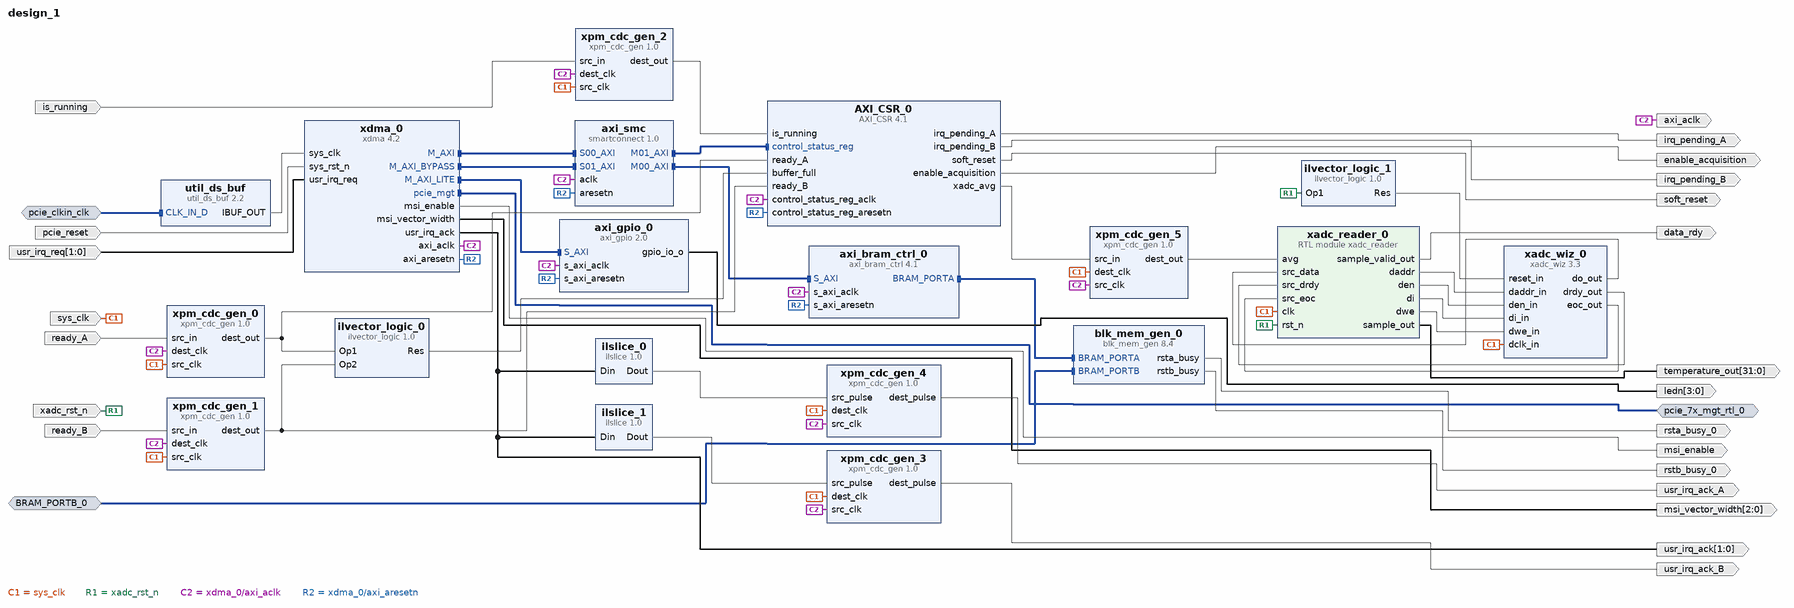
[diagram p0: block diagram of the top level]
# Vivado block design design_1, xc7a100tfgg484-2, Vivado 2025.2
create_bd_design design_1

create_bd_intf_port -mode Master -vlnv xilinx.com:interface:pcie_7x_mgt_rtl:1.0 pcie_7x_mgt_rtl_0
create_bd_intf_port -mode Slave -vlnv xilinx.com:interface:diff_clock_rtl:1.0 pcie_clkin_clk
set_property -dict {CONFIG.FREQ_HZ 100000000} [get_bd_intf_ports pcie_clkin_clk]
create_bd_intf_port -mode Slave -vlnv xilinx.com:interface:bram_rtl:1.0 BRAM_PORTB_0
set_property -dict {CONFIG.MASTER_TYPE BRAM_CTRL CONFIG.READ_WRITE_MODE READ_WRITE} [get_bd_intf_ports BRAM_PORTB_0]
create_bd_port -dir I -type rst pcie_reset
set_property -dict {CONFIG.POLARITY ACTIVE_LOW} [get_bd_ports pcie_reset]
create_bd_port -dir O -from 3 -to 0 -type data ledn
create_bd_port -dir O -type clk axi_aclk
create_bd_port -dir O enable_acquisition
create_bd_port -dir I is_running
create_bd_port -dir O rsta_busy_0
create_bd_port -dir O rstb_busy_0
create_bd_port -dir I -from 1 -to 0 -type intr usr_irq_req
set_property -dict {CONFIG.PortWidth 2} [get_bd_ports usr_irq_req]
create_bd_port -dir O -from 1 -to 0 usr_irq_ack
create_bd_port -dir O msi_enable
create_bd_port -dir O -from 2 -to 0 -type data msi_vector_width
create_bd_port -dir O irq_pending_A
create_bd_port -dir O irq_pending_B
create_bd_port -dir I ready_A
create_bd_port -dir I ready_B
create_bd_port -dir O -type rst soft_reset
create_bd_port -dir I -type clk sys_clk
set_property -dict {CONFIG.CLK_DOMAIN design_1_sys_clk CONFIG.FREQ_HZ 200000000} [get_bd_ports sys_clk]
create_bd_port -dir O usr_irq_ack_A
create_bd_port -dir O usr_irq_ack_B
create_bd_port -dir I -type rst xadc_rst_n
create_bd_port -dir O -from 31 -to 0 temperature_out
create_bd_port -dir O data_rdy

create_bd_cell -type ip -vlnv xilinx.com:ip:xdma:4.2 xdma_0
set_property -dict [list \
  CONFIG.axi_data_width 64_bit \
  CONFIG.axilite_master_en true \
  CONFIG.axist_bypass_en true \
  CONFIG.axist_bypass_scale Megabytes \
  CONFIG.axist_bypass_size 1 \
  CONFIG.axisten_freq 250 \
  CONFIG.cfg_mgmt_if false \
  CONFIG.enable_gtwizard false \
  CONFIG.pciebar2axibar_axist_bypass 0x44A0_0000 \
  CONFIG.pf0_class_code_base FF \
  CONFIG.pf0_class_code_interface 00 \
  CONFIG.pf0_class_code_sub 00 \
  CONFIG.pf0_device_id 7021 \
  CONFIG.pf0_interrupt_pin NONE \
  CONFIG.pl_link_cap_max_link_speed 5.0_GT/s \
  CONFIG.pl_link_cap_max_link_width X4 \
  CONFIG.plltype QPLL1 \
  CONFIG.ref_clk_freq 100_MHz \
  CONFIG.xdma_axi_intf_mm AXI_Memory_Mapped \
  CONFIG.xdma_num_usr_irq 2 \
  CONFIG.xdma_rnum_chnl 1 \
  CONFIG.xdma_wnum_chnl 1 \
] [get_bd_cells xdma_0]
create_bd_cell -type ip -vlnv xilinx.com:ip:axi_gpio:2.0 axi_gpio_0
set_property -dict {CONFIG.C_ALL_OUTPUTS 1 CONFIG.C_DOUT_DEFAULT 0x00000101 CONFIG.C_GPIO_WIDTH 4} [get_bd_cells axi_gpio_0]
create_bd_cell -type ip -vlnv xilinx.com:ip:util_ds_buf:2.2 util_ds_buf
set_property -dict {CONFIG.C_BUF_TYPE IBUFDSGTE} [get_bd_cells util_ds_buf]
create_bd_cell -type ip -vlnv xilinx.com:ip:axi_bram_ctrl:4.1 axi_bram_ctrl_0
set_property -dict {CONFIG.SINGLE_PORT_BRAM 1} [get_bd_cells axi_bram_ctrl_0]
create_bd_cell -type ip -vlnv xilinx.com:ip:blk_mem_gen:8.4 blk_mem_gen_0
set_property -dict {CONFIG.Memory_Type True_Dual_Port_RAM} [get_bd_cells blk_mem_gen_0]
create_bd_cell -type ip -vlnv xilinx.com:ip:smartconnect:1.0 axi_smc
set_property -dict {CONFIG.NUM_MI 2 CONFIG.NUM_SI 2} [get_bd_cells axi_smc]
create_bd_cell -type ip -vlnv Nizar_Homebrew:user:AXI_CSR:4.1 AXI_CSR_0
create_bd_cell -type ip -vlnv xilinx.com:ip:xpm_cdc_gen:1.0 xpm_cdc_gen_0
set_property -dict {CONFIG.CDC_TYPE xpm_cdc_single CONFIG.DEST_SYNC_FF 2} [get_bd_cells xpm_cdc_gen_0]
create_bd_cell -type ip -vlnv xilinx.com:ip:xpm_cdc_gen:1.0 xpm_cdc_gen_1
set_property -dict {CONFIG.CDC_TYPE xpm_cdc_single CONFIG.DEST_SYNC_FF 2} [get_bd_cells xpm_cdc_gen_1]
create_bd_cell -type ip -vlnv xilinx.com:ip:xpm_cdc_gen:1.0 xpm_cdc_gen_2
set_property -dict {CONFIG.CDC_TYPE xpm_cdc_single CONFIG.DEST_SYNC_FF 2} [get_bd_cells xpm_cdc_gen_2]
create_bd_cell -type inline_hdl -vlnv xilinx.com:inline_hdl:ilvector_logic:1.0 ilvector_logic_0
set_property -dict {CONFIG.C_SIZE 1} [get_bd_cells ilvector_logic_0]
create_bd_cell -type ip -vlnv xilinx.com:ip:xpm_cdc_gen:1.0 xpm_cdc_gen_3
set_property -dict {CONFIG.CDC_TYPE xpm_cdc_pulse CONFIG.DEST_SYNC_FF 2 CONFIG.RST_USED false} [get_bd_cells xpm_cdc_gen_3]
create_bd_cell -type ip -vlnv xilinx.com:ip:xpm_cdc_gen:1.0 xpm_cdc_gen_4
set_property -dict {CONFIG.CDC_TYPE xpm_cdc_pulse CONFIG.DEST_SYNC_FF 2 CONFIG.RST_USED false} [get_bd_cells xpm_cdc_gen_4]
create_bd_cell -type inline_hdl -vlnv xilinx.com:inline_hdl:ilslice:1.0 ilslice_0
set_property -dict {CONFIG.DIN_WIDTH 2} [get_bd_cells ilslice_0]
create_bd_cell -type inline_hdl -vlnv xilinx.com:inline_hdl:ilslice:1.0 ilslice_1
set_property -dict {CONFIG.DIN_FROM 1 CONFIG.DIN_TO 1 CONFIG.DIN_WIDTH 2} [get_bd_cells ilslice_1]
create_bd_cell -type module -reference xadc_reader xadc_reader_0
create_bd_cell -type ip -vlnv xilinx.com:ip:xadc_wiz:3.3 xadc_wiz_0
set_property -dict [list \
  CONFIG.ADC_CONVERSION_RATE 40 \
  CONFIG.CHANNEL_AVERAGING 16 \
  CONFIG.DCLK_FREQUENCY 200 \
  CONFIG.ENABLE_RESET true \
  CONFIG.INTERFACE_SELECTION ENABLE_DRP \
  CONFIG.OT_ALARM false \
  CONFIG.SENSOR_OFFSET_AND_GAIN_CALIBRATION true \
  CONFIG.SINGLE_CHANNEL_SELECTION TEMPERATURE \
  CONFIG.USER_TEMP_ALARM false \
  CONFIG.VCCAUX_ALARM false \
  CONFIG.VCCINT_ALARM false \
] [get_bd_cells xadc_wiz_0]
create_bd_cell -type inline_hdl -vlnv xilinx.com:inline_hdl:ilvector_logic:1.0 ilvector_logic_1
set_property -dict {CONFIG.C_OPERATION not CONFIG.C_SIZE 1} [get_bd_cells ilvector_logic_1]
create_bd_cell -type ip -vlnv xilinx.com:ip:xpm_cdc_gen:1.0 xpm_cdc_gen_5
set_property -dict {CONFIG.DEST_SYNC_FF 2 CONFIG.SIM_ASSERT_CHK true} [get_bd_cells xpm_cdc_gen_5]

# ---- connections ----

connect_bd_intf_net -intf_net BRAM_PORTB_0_1 [get_bd_intf_ports BRAM_PORTB_0] [get_bd_intf_pins blk_mem_gen_0/BRAM_PORTB]
connect_bd_intf_net [get_bd_intf_pins blk_mem_gen_0/BRAM_PORTA] [get_bd_intf_pins axi_bram_ctrl_0/BRAM_PORTA]
connect_bd_intf_net [get_bd_intf_pins axi_smc/M00_AXI] [get_bd_intf_pins axi_bram_ctrl_0/S_AXI]
connect_bd_intf_net [get_bd_intf_pins axi_smc/M01_AXI] [get_bd_intf_pins AXI_CSR_0/control_status_reg]
connect_bd_intf_net -intf_net diff_clock_rtl_0_1 [get_bd_intf_ports pcie_clkin_clk] [get_bd_intf_pins util_ds_buf/CLK_IN_D]
connect_bd_intf_net [get_bd_intf_pins xdma_0/M_AXI] [get_bd_intf_pins axi_smc/S00_AXI]
connect_bd_intf_net [get_bd_intf_pins xdma_0/M_AXI_BYPASS] [get_bd_intf_pins axi_smc/S01_AXI]
connect_bd_intf_net [get_bd_intf_pins xdma_0/M_AXI_LITE] [get_bd_intf_pins axi_gpio_0/S_AXI]
connect_bd_intf_net [get_bd_intf_ports pcie_7x_mgt_rtl_0] [get_bd_intf_pins xdma_0/pcie_mgt]
connect_bd_net [get_bd_pins AXI_CSR_0/irq_pending_A] [get_bd_ports irq_pending_A]
connect_bd_net [get_bd_pins AXI_CSR_0/irq_pending_B] [get_bd_ports irq_pending_B]
connect_bd_net [get_bd_pins AXI_CSR_0/soft_reset] [get_bd_ports soft_reset]
connect_bd_net [get_bd_pins AXI_CSR_0/xadc_avg] [get_bd_pins xpm_cdc_gen_5/src_in]
connect_bd_net [get_bd_pins AXI_CSR_0/enable_acquisition] [get_bd_ports enable_acquisition]
connect_bd_net [get_bd_pins axi_gpio_0/gpio_io_o] [get_bd_ports ledn]
connect_bd_net [get_bd_pins blk_mem_gen_0/rsta_busy] [get_bd_ports rsta_busy_0]
connect_bd_net [get_bd_pins blk_mem_gen_0/rstb_busy] [get_bd_ports rstb_busy_0]
connect_bd_net [get_bd_pins ilslice_0/Dout] [get_bd_pins xpm_cdc_gen_4/src_pulse]
connect_bd_net [get_bd_pins ilslice_1/Dout] [get_bd_pins xpm_cdc_gen_3/src_pulse]
connect_bd_net [get_bd_pins ilvector_logic_0/Res] [get_bd_pins AXI_CSR_0/buffer_full]
connect_bd_net [get_bd_pins ilvector_logic_1/Res] [get_bd_pins xadc_wiz_0/reset_in]
connect_bd_net [get_bd_ports is_running] [get_bd_pins xpm_cdc_gen_2/src_in]
connect_bd_net [get_bd_ports ready_A] [get_bd_pins xpm_cdc_gen_0/src_in]
connect_bd_net [get_bd_ports ready_B] [get_bd_pins xpm_cdc_gen_1/src_in]
connect_bd_net -net reset_rtl_0_1 [get_bd_ports pcie_reset] [get_bd_pins xdma_0/sys_rst_n]
connect_bd_net -net src_clk_1 [get_bd_ports sys_clk] \
  [get_bd_pins xpm_cdc_gen_0/src_clk] [get_bd_pins xpm_cdc_gen_2/src_clk] [get_bd_pins xpm_cdc_gen_1/src_clk] \
  [get_bd_pins xpm_cdc_gen_3/dest_clk] [get_bd_pins xpm_cdc_gen_4/dest_clk] [get_bd_pins xadc_wiz_0/dclk_in] \
  [get_bd_pins xpm_cdc_gen_5/dest_clk] [get_bd_pins xadc_reader_0/clk]
connect_bd_net [get_bd_ports usr_irq_req] [get_bd_pins xdma_0/usr_irq_req]
connect_bd_net [get_bd_pins util_ds_buf/IBUF_OUT] [get_bd_pins xdma_0/sys_clk]
connect_bd_net [get_bd_pins xadc_reader_0/daddr] [get_bd_pins xadc_wiz_0/daddr_in]
connect_bd_net -net xadc_reader_0_data_rdy [get_bd_pins xadc_reader_0/sample_valid_out] [get_bd_ports data_rdy]
connect_bd_net [get_bd_pins xadc_reader_0/den] [get_bd_pins xadc_wiz_0/den_in]
connect_bd_net [get_bd_pins xadc_reader_0/di] [get_bd_pins xadc_wiz_0/di_in]
connect_bd_net [get_bd_pins xadc_reader_0/dwe] [get_bd_pins xadc_wiz_0/dwe_in]
connect_bd_net [get_bd_pins xadc_reader_0/sample_out] [get_bd_ports temperature_out]
connect_bd_net [get_bd_ports xadc_rst_n] [get_bd_pins ilvector_logic_1/Op1] [get_bd_pins xadc_reader_0/rst_n]
connect_bd_net [get_bd_pins xadc_wiz_0/do_out] [get_bd_pins xadc_reader_0/src_data]
connect_bd_net [get_bd_pins xadc_wiz_0/drdy_out] [get_bd_pins xadc_reader_0/src_drdy]
connect_bd_net [get_bd_pins xadc_wiz_0/eoc_out] [get_bd_pins xadc_reader_0/src_eoc]
connect_bd_net [get_bd_pins xdma_0/axi_aclk] \
  [get_bd_pins axi_gpio_0/s_axi_aclk] [get_bd_pins axi_smc/aclk] [get_bd_pins axi_bram_ctrl_0/s_axi_aclk] \
  [get_bd_ports axi_aclk] [get_bd_pins xpm_cdc_gen_0/dest_clk] [get_bd_pins xpm_cdc_gen_1/dest_clk] \
  [get_bd_pins xpm_cdc_gen_2/dest_clk] [get_bd_pins xpm_cdc_gen_3/src_clk] [get_bd_pins xpm_cdc_gen_4/src_clk] \
  [get_bd_pins xpm_cdc_gen_5/src_clk] [get_bd_pins AXI_CSR_0/control_status_reg_aclk]
connect_bd_net [get_bd_pins xdma_0/axi_aresetn] \
  [get_bd_pins axi_gpio_0/s_axi_aresetn] [get_bd_pins axi_bram_ctrl_0/s_axi_aresetn] [get_bd_pins axi_smc/aresetn] \
  [get_bd_pins AXI_CSR_0/control_status_reg_aresetn]
connect_bd_net [get_bd_pins xdma_0/msi_enable] [get_bd_ports msi_enable]
connect_bd_net [get_bd_pins xdma_0/msi_vector_width] [get_bd_ports msi_vector_width]
connect_bd_net [get_bd_pins xdma_0/usr_irq_ack] [get_bd_ports usr_irq_ack] [get_bd_pins ilslice_0/Din] [get_bd_pins ilslice_1/Din]
connect_bd_net [get_bd_pins xpm_cdc_gen_0/dest_out] [get_bd_pins ilvector_logic_0/Op1] [get_bd_pins AXI_CSR_0/ready_A]
connect_bd_net [get_bd_pins xpm_cdc_gen_1/dest_out] [get_bd_pins ilvector_logic_0/Op2] [get_bd_pins AXI_CSR_0/ready_B]
connect_bd_net [get_bd_pins xpm_cdc_gen_2/dest_out] [get_bd_pins AXI_CSR_0/is_running]
connect_bd_net [get_bd_pins xpm_cdc_gen_3/dest_pulse] [get_bd_ports usr_irq_ack_B]
connect_bd_net [get_bd_pins xpm_cdc_gen_4/dest_pulse] [get_bd_ports usr_irq_ack_A]
connect_bd_net [get_bd_pins xpm_cdc_gen_5/dest_out] [get_bd_pins xadc_reader_0/avg]

# ---- address map ----
assign_bd_address -offset 0x0000000044A00000 -range 128 -target_address_space [get_bd_addr_spaces xdma_0/M_AXI] [get_bd_addr_segs AXI_CSR_0/control_status_reg/reg0]
assign_bd_address -offset 0x0000000044A02000 -range 8K -target_address_space [get_bd_addr_spaces xdma_0/M_AXI] [get_bd_addr_segs axi_bram_ctrl_0/S_AXI/Mem0]
assign_bd_address -offset 0x0000000044A00000 -range 128 -target_address_space [get_bd_addr_spaces xdma_0/M_AXI_BYPASS] [get_bd_addr_segs AXI_CSR_0/control_status_reg/reg0]
assign_bd_address -offset 0x0000000044A02000 -range 8K -target_address_space [get_bd_addr_spaces xdma_0/M_AXI_BYPASS] [get_bd_addr_segs axi_bram_ctrl_0/S_AXI/Mem0]
assign_bd_address -offset 0x00000000 -range 64K -target_address_space [get_bd_addr_spaces xdma_0/M_AXI_LITE] [get_bd_addr_segs axi_gpio_0/S_AXI/Reg]

validate_bd_design
save_bd_design
